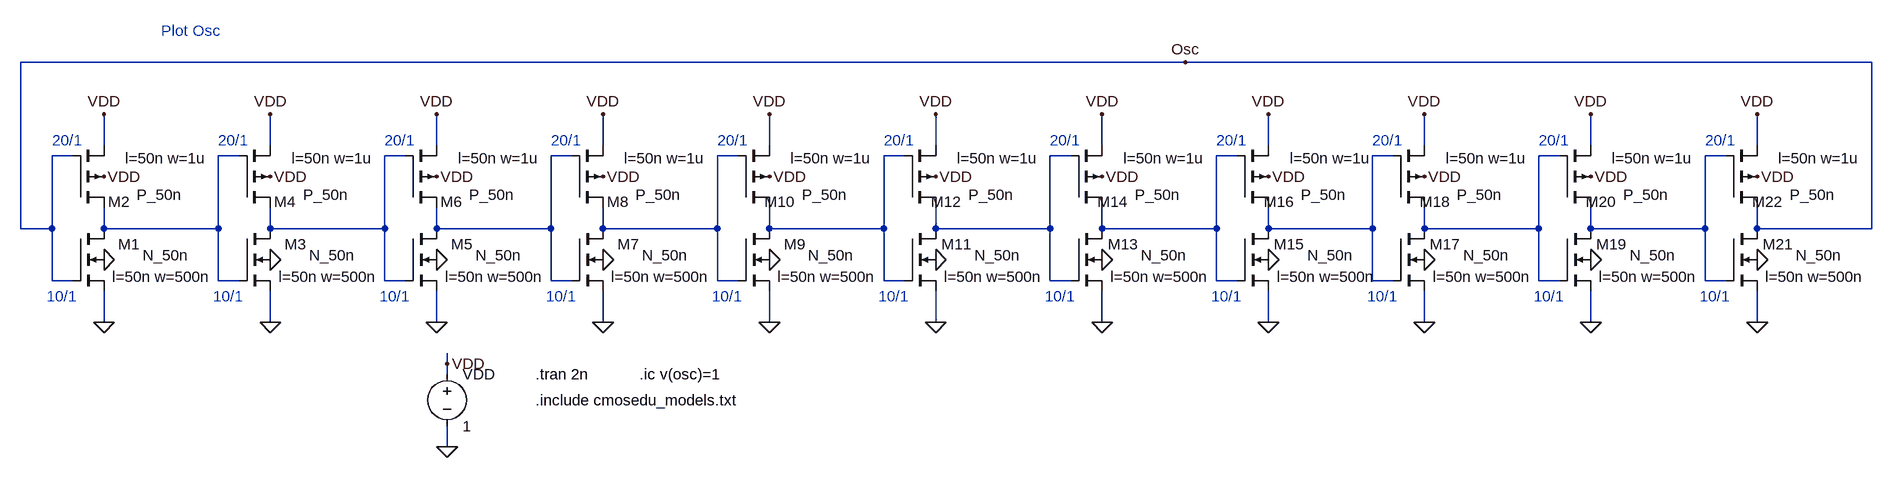
[diagram p0: schematic Fig11_14.asc]
Fig11_14.asc, the LTspice schematic file:
Version 4
SHEET 1 3172 680
WIRE 2112 -432 320 -432
WIRE 3168 -432 2112 -432
WIRE 448 -304 448 -352
WIRE 704 -304 704 -352
WIRE 960 -304 960 -352
WIRE 1216 -304 1216 -352
WIRE 1472 -304 1472 -352
WIRE 1728 -304 1728 -352
WIRE 1984 -304 1984 -352
WIRE 2240 -304 2240 -352
WIRE 2480 -304 2480 -352
WIRE 2736 -304 2736 -352
WIRE 2992 -304 2992 -352
WIRE 400 -288 368 -288
WIRE 656 -288 624 -288
WIRE 912 -288 880 -288
WIRE 1168 -288 1136 -288
WIRE 1424 -288 1392 -288
WIRE 1680 -288 1648 -288
WIRE 1936 -288 1904 -288
WIRE 2192 -288 2160 -288
WIRE 2432 -288 2400 -288
WIRE 2688 -288 2656 -288
WIRE 2944 -288 2912 -288
WIRE 320 -176 320 -432
WIRE 368 -176 368 -288
WIRE 368 -176 320 -176
WIRE 448 -176 448 -208
WIRE 624 -176 624 -288
WIRE 624 -176 448 -176
WIRE 704 -176 704 -208
WIRE 880 -176 880 -288
WIRE 880 -176 704 -176
WIRE 960 -176 960 -208
WIRE 1136 -176 1136 -288
WIRE 1136 -176 960 -176
WIRE 1216 -176 1216 -208
WIRE 1392 -176 1392 -288
WIRE 1392 -176 1216 -176
WIRE 1472 -176 1472 -208
WIRE 1648 -176 1648 -288
WIRE 1648 -176 1472 -176
WIRE 1728 -176 1728 -208
WIRE 1904 -176 1904 -288
WIRE 1904 -176 1728 -176
WIRE 1984 -176 1984 -208
WIRE 2160 -176 2160 -288
WIRE 2160 -176 1984 -176
WIRE 2240 -176 2240 -208
WIRE 2400 -176 2400 -288
WIRE 2400 -176 2240 -176
WIRE 2480 -176 2480 -208
WIRE 2656 -176 2656 -288
WIRE 2656 -176 2480 -176
WIRE 2736 -176 2736 -208
WIRE 2912 -176 2912 -288
WIRE 2912 -176 2736 -176
WIRE 2992 -176 2992 -208
WIRE 3168 -176 3168 -432
WIRE 3168 -176 2992 -176
WIRE 368 -96 368 -176
WIRE 400 -96 368 -96
WIRE 624 -96 624 -176
WIRE 656 -96 624 -96
WIRE 880 -96 880 -176
WIRE 912 -96 880 -96
WIRE 1136 -96 1136 -176
WIRE 1168 -96 1136 -96
WIRE 1392 -96 1392 -176
WIRE 1424 -96 1392 -96
WIRE 1648 -96 1648 -176
WIRE 1680 -96 1648 -96
WIRE 1904 -96 1904 -176
WIRE 1936 -96 1904 -96
WIRE 2160 -96 2160 -176
WIRE 2192 -96 2160 -96
WIRE 2400 -96 2400 -176
WIRE 2432 -96 2400 -96
WIRE 2656 -96 2656 -176
WIRE 2688 -96 2656 -96
WIRE 2912 -96 2912 -176
WIRE 2944 -96 2912 -96
WIRE 448 -32 448 -80
WIRE 704 -32 704 -80
WIRE 960 -32 960 -80
WIRE 1216 -32 1216 -80
WIRE 1472 -32 1472 -80
WIRE 1728 -32 1728 -80
WIRE 1984 -32 1984 -80
WIRE 2240 -32 2240 -80
WIRE 2480 -32 2480 -80
WIRE 2736 -32 2736 -80
WIRE 2992 -32 2992 -80
WIRE 976 32 976 16
WIRE 976 48 976 32
WIRE 976 160 976 128
FLAG 448 -128 0
FLAG 976 160 0
FLAG 976 32 VDD
FLAG 448 -256 VDD
FLAG 448 -32 0
FLAG 448 -352 VDD
FLAG 704 -128 0
FLAG 704 -256 VDD
FLAG 704 -32 0
FLAG 704 -352 VDD
FLAG 960 -128 0
FLAG 960 -256 VDD
FLAG 960 -32 0
FLAG 960 -352 VDD
FLAG 1216 -128 0
FLAG 1216 -256 VDD
FLAG 1216 -32 0
FLAG 1216 -352 VDD
FLAG 1472 -128 0
FLAG 1472 -256 VDD
FLAG 1472 -32 0
FLAG 1472 -352 VDD
FLAG 1728 -128 0
FLAG 1728 -256 VDD
FLAG 1728 -32 0
FLAG 1728 -352 VDD
FLAG 1984 -128 0
FLAG 1984 -256 VDD
FLAG 1984 -32 0
FLAG 1984 -352 VDD
FLAG 2240 -128 0
FLAG 2240 -256 VDD
FLAG 2240 -32 0
FLAG 2240 -352 VDD
FLAG 2480 -128 0
FLAG 2480 -256 VDD
FLAG 2480 -32 0
FLAG 2480 -352 VDD
FLAG 2736 -128 0
FLAG 2736 -256 VDD
FLAG 2736 -32 0
FLAG 2736 -352 VDD
FLAG 2992 -128 0
FLAG 2992 -256 VDD
FLAG 2992 -32 0
FLAG 2992 -352 VDD
FLAG 2112 -432 Osc
SYMBOL nmos4 400 -176 R0
WINDOW 0 104 24 Right 2
WINDOW 3 179 41 Right 2
WINDOW 123 213 74 Right 2
SYMATTR InstName M1
SYMATTR Value N_50n
SYMATTR Value2 l=50n w=500n
SYMBOL voltage 976 32 R0
WINDOW 123 0 0 Left 2
WINDOW 39 0 0 Left 2
SYMATTR InstName VDD
SYMATTR Value 1
SYMBOL pmos4 400 -208 M180
WINDOW 0 88 9 Right 2
WINDOW 3 168 20 Right 2
WINDOW 123 206 76 Right 2
SYMATTR InstName M2
SYMATTR Value P_50n
SYMATTR Value2 l=50n w=1u
SYMBOL nmos4 656 -176 R0
WINDOW 0 104 24 Right 2
WINDOW 3 179 41 Right 2
WINDOW 123 213 74 Right 2
SYMATTR InstName M3
SYMATTR Value N_50n
SYMATTR Value2 l=50n w=500n
SYMBOL pmos4 656 -208 M180
WINDOW 0 88 9 Right 2
WINDOW 3 168 20 Right 2
WINDOW 123 206 76 Right 2
SYMATTR InstName M4
SYMATTR Value P_50n
SYMATTR Value2 l=50n w=1u
SYMBOL nmos4 912 -176 R0
WINDOW 0 104 24 Right 2
WINDOW 3 179 41 Right 2
WINDOW 123 213 74 Right 2
SYMATTR InstName M5
SYMATTR Value N_50n
SYMATTR Value2 l=50n w=500n
SYMBOL pmos4 912 -208 M180
WINDOW 0 88 9 Right 2
WINDOW 3 168 20 Right 2
WINDOW 123 206 76 Right 2
SYMATTR InstName M6
SYMATTR Value P_50n
SYMATTR Value2 l=50n w=1u
SYMBOL nmos4 1168 -176 R0
WINDOW 0 104 24 Right 2
WINDOW 3 179 41 Right 2
WINDOW 123 213 74 Right 2
SYMATTR InstName M7
SYMATTR Value N_50n
SYMATTR Value2 l=50n w=500n
SYMBOL pmos4 1168 -208 M180
WINDOW 0 88 9 Right 2
WINDOW 3 168 20 Right 2
WINDOW 123 206 76 Right 2
SYMATTR InstName M8
SYMATTR Value P_50n
SYMATTR Value2 l=50n w=1u
SYMBOL nmos4 1424 -176 R0
WINDOW 0 104 24 Right 2
WINDOW 3 179 41 Right 2
WINDOW 123 213 74 Right 2
SYMATTR InstName M9
SYMATTR Value N_50n
SYMATTR Value2 l=50n w=500n
SYMBOL pmos4 1424 -208 M180
WINDOW 0 88 9 Right 2
WINDOW 3 168 20 Right 2
WINDOW 123 206 76 Right 2
SYMATTR InstName M10
SYMATTR Value P_50n
SYMATTR Value2 l=50n w=1u
SYMBOL nmos4 1680 -176 R0
WINDOW 0 104 24 Right 2
WINDOW 3 179 41 Right 2
WINDOW 123 213 74 Right 2
SYMATTR InstName M11
SYMATTR Value N_50n
SYMATTR Value2 l=50n w=500n
SYMBOL pmos4 1680 -208 M180
WINDOW 0 88 9 Right 2
WINDOW 3 168 20 Right 2
WINDOW 123 206 76 Right 2
SYMATTR InstName M12
SYMATTR Value P_50n
SYMATTR Value2 l=50n w=1u
SYMBOL nmos4 1936 -176 R0
WINDOW 0 104 24 Right 2
WINDOW 3 179 41 Right 2
WINDOW 123 213 74 Right 2
SYMATTR InstName M13
SYMATTR Value N_50n
SYMATTR Value2 l=50n w=500n
SYMBOL pmos4 1936 -208 M180
WINDOW 0 88 9 Right 2
WINDOW 3 168 20 Right 2
WINDOW 123 206 76 Right 2
SYMATTR InstName M14
SYMATTR Value P_50n
SYMATTR Value2 l=50n w=1u
SYMBOL nmos4 2192 -176 R0
WINDOW 0 104 24 Right 2
WINDOW 3 179 41 Right 2
WINDOW 123 213 74 Right 2
SYMATTR InstName M15
SYMATTR Value N_50n
SYMATTR Value2 l=50n w=500n
SYMBOL pmos4 2192 -208 M180
WINDOW 0 88 9 Right 2
WINDOW 3 168 20 Right 2
WINDOW 123 206 76 Right 2
SYMATTR InstName M16
SYMATTR Value P_50n
SYMATTR Value2 l=50n w=1u
SYMBOL nmos4 2432 -176 R0
WINDOW 0 104 24 Right 2
WINDOW 3 179 41 Right 2
WINDOW 123 213 74 Right 2
SYMATTR InstName M17
SYMATTR Value N_50n
SYMATTR Value2 l=50n w=500n
SYMBOL pmos4 2432 -208 M180
WINDOW 0 88 9 Right 2
WINDOW 3 168 20 Right 2
WINDOW 123 206 76 Right 2
SYMATTR InstName M18
SYMATTR Value P_50n
SYMATTR Value2 l=50n w=1u
SYMBOL nmos4 2688 -176 R0
WINDOW 0 104 24 Right 2
WINDOW 3 179 41 Right 2
WINDOW 123 213 74 Right 2
SYMATTR InstName M19
SYMATTR Value N_50n
SYMATTR Value2 l=50n w=500n
SYMBOL pmos4 2688 -208 M180
WINDOW 0 88 9 Right 2
WINDOW 3 168 20 Right 2
WINDOW 123 206 76 Right 2
SYMATTR InstName M20
SYMATTR Value P_50n
SYMATTR Value2 l=50n w=1u
SYMBOL nmos4 2944 -176 R0
WINDOW 0 104 24 Right 2
WINDOW 3 179 41 Right 2
WINDOW 123 213 74 Right 2
SYMATTR InstName M21
SYMATTR Value N_50n
SYMATTR Value2 l=50n w=500n
SYMBOL pmos4 2944 -208 M180
WINDOW 0 88 9 Right 2
WINDOW 3 168 20 Right 2
WINDOW 123 206 76 Right 2
SYMATTR InstName M22
SYMATTR Value P_50n
SYMATTR Value2 l=50n w=1u
TEXT 1112 48 Left 2 !.tran 2n
TEXT 1112 88 Left 2 !.include cmosedu_models.txt
TEXT 536 -480 Left 2 ;Plot Osc
TEXT 368 -312 Left 2 ;20/1
TEXT 360 -72 Left 2 ;10/1
TEXT 624 -312 Left 2 ;20/1
TEXT 616 -72 Left 2 ;10/1
TEXT 880 -312 Left 2 ;20/1
TEXT 872 -72 Left 2 ;10/1
TEXT 1136 -312 Left 2 ;20/1
TEXT 1128 -72 Left 2 ;10/1
TEXT 1392 -312 Left 2 ;20/1
TEXT 1384 -72 Left 2 ;10/1
TEXT 1648 -312 Left 2 ;20/1
TEXT 1640 -72 Left 2 ;10/1
TEXT 1904 -312 Left 2 ;20/1
TEXT 1896 -72 Left 2 ;10/1
TEXT 2160 -312 Left 2 ;20/1
TEXT 2152 -72 Left 2 ;10/1
TEXT 2400 -312 Left 2 ;20/1
TEXT 2392 -72 Left 2 ;10/1
TEXT 2656 -312 Left 2 ;20/1
TEXT 2648 -72 Left 2 ;10/1
TEXT 2912 -312 Left 2 ;20/1
TEXT 2904 -72 Left 2 ;10/1
TEXT 1272 48 Left 2 !.ic v(osc)=1

The netlist it stands for:
* Fig11_14.asc
M1 N001 Osc 0 0 N_50n l=50n w=500n
VDD VDD 0 1
M2 N001 Osc VDD VDD P_50n l=50n w=1u
M3 N002 N001 0 0 N_50n l=50n w=500n
M4 N002 N001 VDD VDD P_50n l=50n w=1u
M5 N003 N002 0 0 N_50n l=50n w=500n
M6 N003 N002 VDD VDD P_50n l=50n w=1u
M7 N004 N003 0 0 N_50n l=50n w=500n
M8 N004 N003 VDD VDD P_50n l=50n w=1u
M9 N005 N004 0 0 N_50n l=50n w=500n
M10 N005 N004 VDD VDD P_50n l=50n w=1u
M11 N006 N005 0 0 N_50n l=50n w=500n
M12 N006 N005 VDD VDD P_50n l=50n w=1u
M13 N007 N006 0 0 N_50n l=50n w=500n
M14 N007 N006 VDD VDD P_50n l=50n w=1u
M15 N008 N007 0 0 N_50n l=50n w=500n
M16 N008 N007 VDD VDD P_50n l=50n w=1u
M17 N009 N008 0 0 N_50n l=50n w=500n
M18 N009 N008 VDD VDD P_50n l=50n w=1u
M19 N010 N009 0 0 N_50n l=50n w=500n
M20 N010 N009 VDD VDD P_50n l=50n w=1u
M21 Osc N010 0 0 N_50n l=50n w=500n
M22 Osc N010 VDD VDD P_50n l=50n w=1u
.model NMOS NMOS
.model PMOS PMOS
.lib standard.mos
.tran 2n
.include cmosedu_models.txt
* Plot Osc
* 20/1
* 10/1
* 20/1
* 10/1
* 20/1
* 10/1
* 20/1
* 10/1
* 20/1
* 10/1
* 20/1
* 10/1
* 20/1
* 10/1
* 20/1
* 10/1
* 20/1
* 10/1
* 20/1
* 10/1
* 20/1
* 10/1
.ic v(osc)=1
.backanno
.end